# EAGLE schematic breakout_v0.2 (EAGLE 9.3.2)
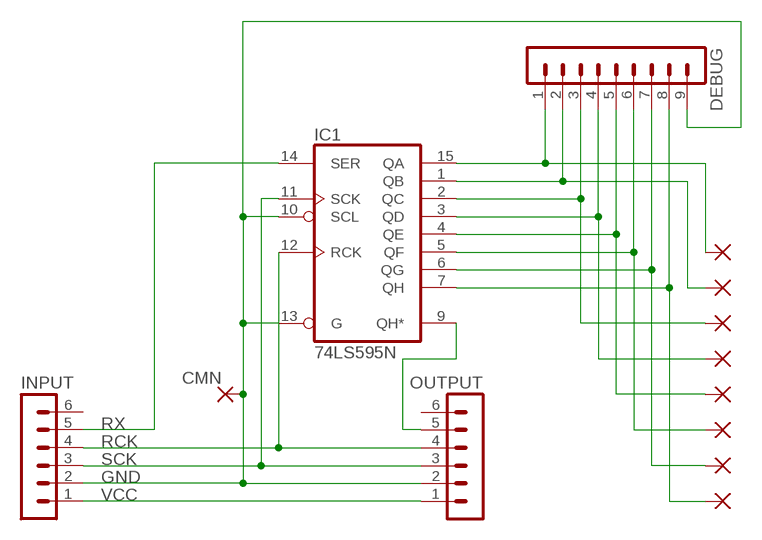
[diagram p0: schematic, sheet 1]

## Parts
CMN  1,6/0,8  [1,6/0,8]
DEBUG  MA09-1  [MA09-1]
DEC  1,6/0,8  [1,6/0,8]
IC1  74LS595N  [DIL16]
INPUT  MA06-1  [MA06-1]
OUTPUT  MA06-1  [MA06-1]
SEGA  1,6/0,8  [1,6/0,8]
SEGB  1,6/0,8  [1,6/0,8]
SEGC  1,6/0,8  [1,6/0,8]
SEGD  1,6/0,8  [1,6/0,8]
SEGE  1,6/0,8  [1,6/0,8]
SEGF  1,6/0,8  [1,6/0,8]
SEGG  1,6/0,8  [1,6/0,8]

## Nets
GND [ground]: CMN.1(P) DEBUG.9 IC1.10(SCL) IC1.13(G) INPUT.2 OUTPUT.2
N$1: DEBUG.1 IC1.15(QA) SEGA.1(P)
N$2: IC1.9(QH*) OUTPUT.5
N$3: DEBUG.3 IC1.2(QC) SEGC.1(P)
N$4: DEBUG.4 IC1.3(QD) SEGD.1(P)
N$5: DEBUG.5 IC1.4(QE) SEGE.1(P)
N$6: DEBUG.6 IC1.5(QF) SEGF.1(P)
N$7: DEBUG.7 IC1.6(QG) SEGG.1(P)
N$8: DEBUG.8 DEC.1(P) IC1.7(QH)
N$10: DEBUG.2 IC1.1(QB) SEGB.1(P)
RCK: IC1.12(RCK) INPUT.4 OUTPUT.4
RX: IC1.14(SER) INPUT.5
SCK: IC1.11(SCK) INPUT.3 OUTPUT.3
VCC [vcc]: INPUT.1 OUTPUT.1
Unconnected: INPUT.6 OUTPUT.6

## Power pins joined to a net without a drawn wire
GND: IC1.8(GND)
VCC: IC1.16(VCC)

## Library data of the parts
CMN DEC SEGA SEGB SEGC SEGD SEGE SEGF SEGG = wirepad:1,6/0,8: THROUGH-HOLE PAD
DEBUG = con-lstb:MA09-1: PIN HEADER; OC_FARNELL: unknown; OC_NEWARK: unknown
IC1 = 74xx-eu:74*595: 8-bit SHIFT REGISTER, output latch
INPUT OUTPUT = con-lstb:MA06-1: PIN HEADER; OC_FARNELL: unknown; OC_NEWARK: unknown

## Net classes
0 default: width 0.635 mm
1 ground: width 1.27 mm
2 vcc: width 1.27 mm
3 audio: width 1.27 mm